# EAGLE schematic LCDShieldC144MVGI v1 (EAGLE 5.11)
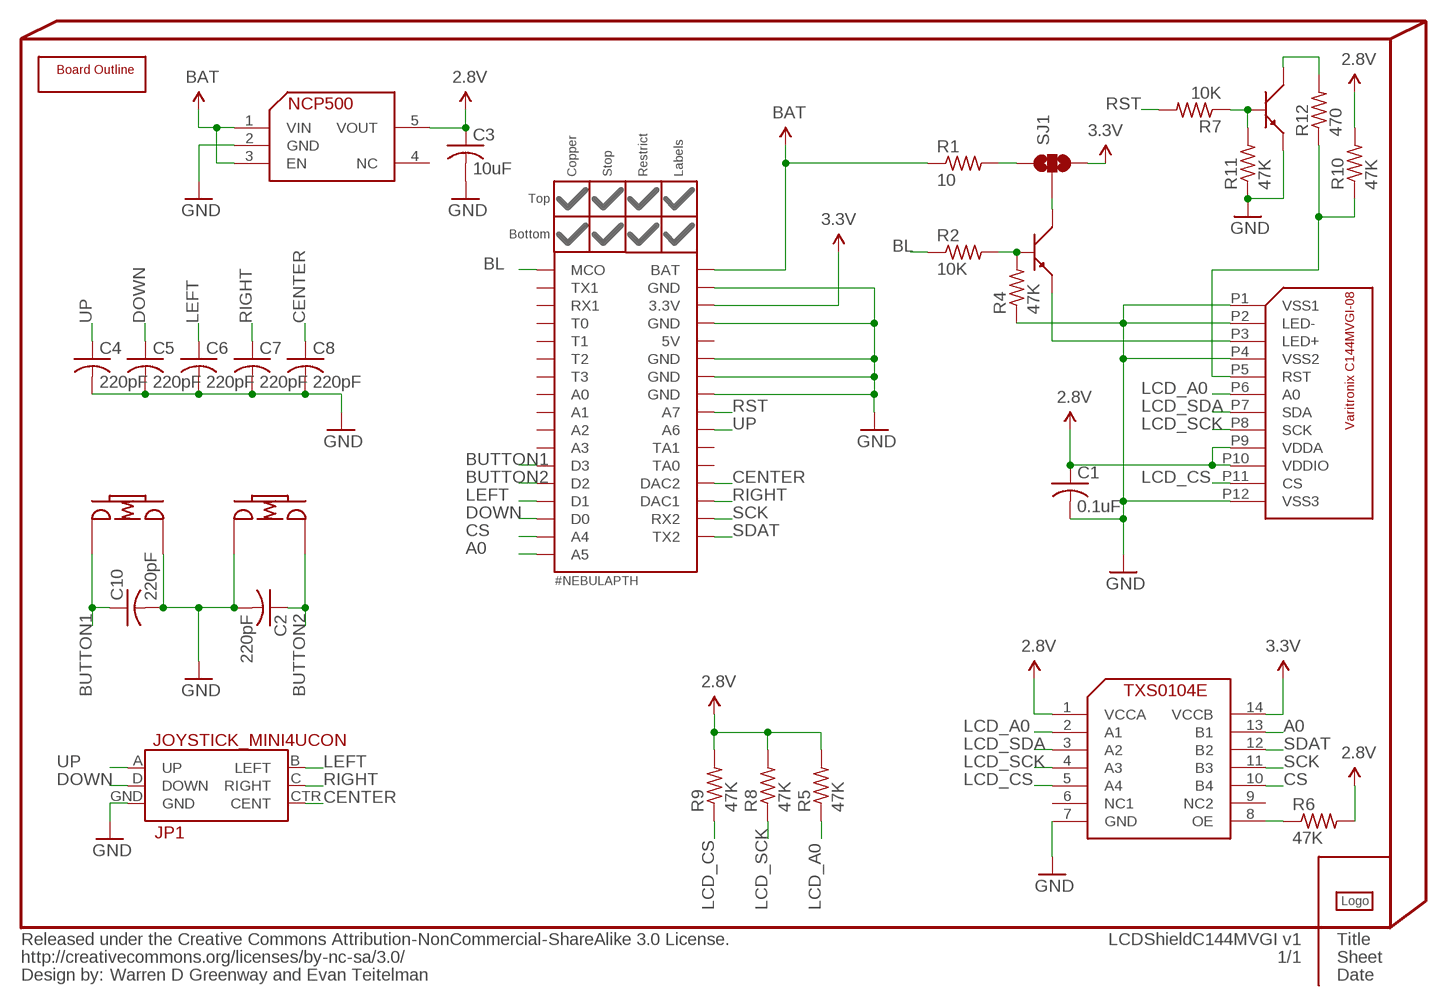
[diagram p0: schematic, sheet 1]

## Parts
BOARDOUTLINE  #NEBULA-VARITRONIX-OUTLINE  [#NEBULA-VARITRONIX-OUTLINE]
C1  0.1uF  C-USC0402  [C0402]
C2  220pF  C-USC0402  [C0402]
C3  10uF  C-USC0805  [C0805]
C4  220pF  C-USC0402  [C0402]
C5  220pF  C-USC0402  [C0402]
C6  220pF  C-USC0402  [C0402]
C7  220pF  C-USC0402  [C0402]
C8  220pF  C-USC0402  [C0402]
C10  220pF  C-USC0402  [C0402]
INFO3  Warren D Greenway and Evan Teitelman  %CC-NC-SA  [%CC-NC-SA]
JP1  JOYSTICK_MINI4UCON  [JOYSTICK_MINI]
LOGO1  #PYGMYLOGOLARGE  [#PYGMYLOGO]
NEBULA1  #NEBULAPTH  [#NEBULA-PTH]
R1  10  R-US_R0805  [R0805]
R2  10K  R-US_R0402  [R0402]
R4  47K  R-US_R0402  [R0402]
R5  47K  R-US_R0402  [R0402]
R6  47K  R-US_R0402  [R0402]
R7  10K  R-US_R0402  [R0402]
R8  47K  R-US_R0402  [R0402]
R9  47K  R-US_R0402  [R0402]
R10  47K  R-US_R0402  [R0402]
R11  47K  R-US_R0402  [R0402]
R12  470  R-US_R0402  [R0402]
SJ1  SOLDERJUMPER_2WAYPASTE1&2  [SJ_3_PASTE1&2]
U1  VARITRONIX_COG-C144MVGI-08FOLDED  [VARITRONIX_COG-C144MVGI-08_FOLDED]
U2  BIPOLAR-PMBT6428  [DUBLIB_SOT23]
U3  INTERFACE-TXS0104E  [PW_R-PDSO-G14]
U4  NCP500  [SOT23-5L]
U5  BIPOLAR-PMBT6428  [DUBLIB_SOT23]
U6  SWITCH-ALPS-SKRG  [SWITCH-2P-5MM]
U7  SWITCH-ALPS-SKRG  [SWITCH-2P-5MM]

## Nets
2.8V: C1.1 C3.1 R5.2 R6.2 R8.2 R9.2 R10.2 U1.P9(VDDA) U1.P10(VDDIO) U3.1(VCCA) U4.5(VOUT) ; supply symbol labelled @2.8V
3.3V: NEBULA1.3.3V SJ1.3 U3.14(VCCB) ; supply symbol labelled @3.3V
A0: NEBULA1.A5 U3.13(B1)
BAT: NEBULA1.BAT R1.1 U4.1(VIN) U4.3(EN) ; supply symbol labelled @BAT
BL: NEBULA1.MCO R2.1
BUTTON1: C10.1 NEBULA1.D3 U7.P1
BUTTON2: C2.1 NEBULA1.D2 U6.P2
CENTER: C8.1 JP1.CTR(CENT) NEBULA1.DAC2
CS: NEBULA1.A4 U3.10(B4)
DOWN: C5.1 JP1.D(DOWN) NEBULA1.D0
GND: C1.2 C2.2 C3.2 C4.2 C5.2 C6.2 C7.2 C8.2 C10.2 JP1.GND NEBULA1.GND1(GND) NEBULA1.GND2(GND) NEBULA1.GND3(GND) NEBULA1.GND4(GND) NEBULA1.GND5(GND) R4.1 R11.1 U1.P1(VSS1) U1.P2(LED-) U1.P4(VSS2) U1.P12(VSS3) U3.7(GND) U4.2(GND) U5.2 U6.P1 U7.P2 ; supply symbol labelled @GND
LCD_A0: R5.1 U1.P6(A0) U3.2(A1)
LCD_CS: R9.1 U1.P11(CS) U3.5(A4)
LCD_SCK: R8.1 U1.P8(SCK) U3.4(A3)
LCD_SDA: U1.P7(SDA) U3.3(A2)
LEFT: C6.1 JP1.B(LEFT) NEBULA1.D1
N$1: SJ1.2 U2.3
N$2: R1.2 SJ1.1
N$3: R6.1 U3.8(OE)
N$4: R7.1 R11.2 U5.1
N$5: R12.2 U5.3
N$6: U1.P3(LED+) U2.2
N$7: R2.2 R4.2 U2.1
N$9: R10.1 R12.1 U1.P5(RST)
RIGHT: C7.1 JP1.C(RIGHT) NEBULA1.DAC1
RST: NEBULA1.A7 R7.2
SCK: NEBULA1.COM2_RX(RX2) U3.11(B3)
SDAT: NEBULA1.COM2_TX(TX2) U3.12(B2)
UP: C4.1 JP1.A(UP) NEBULA1.A6
Unconnected: NEBULA1.5V NEBULA1.A0 NEBULA1.A1 NEBULA1.A2 NEBULA1.A3 NEBULA1.COM1_RX(RX1) NEBULA1.COM1_TX(TX1) NEBULA1.T0 NEBULA1.T1 NEBULA1.T2 NEBULA1.T3 NEBULA1.TA0 NEBULA1.TA1 U3.6(NC1) U3.9(NC2) U4.4(NC)

## Library data of the parts
BOARDOUTLINE = PygmyBoards:#NEBULA-VARITRONIX-OUTLINE
C1-C8 C10 = rcl:C-US: CAPACITOR, American symbol
INFO3 = PygmyBoards:%CC-NC-SA: Released under the Creative Commons Attribution-NonCommercial-ShareAlike 3.0 License. http://creativecommons.org/licenses/by-sa/3.0 Design by: [Designer Name] Change this part's value to change the designer name
JP1 = SparkFun:JOYSTICK_MINI
LOGO1 = Pygmy:#PYGMYLOGO
NEBULA1 = PygmyBoards:#NEBULA: Nebula Board and Shield Footprint Pads This is the only absolutely required part for the footprint. The parts in "#NEBULA-PART" are merely aesthetic. A circular board outline should be .001" thick and 1.005" in diameter (Reference circle on the Document (48) layer provided).
R1 R2 R4-R12 = rcl:R-US_: RESISTOR, American symbol
SJ1 = Pygmy:SOLDERJUMPER_2WAY: Solder Jumper 2 way solder jumper
U1 = Pygmy:VARITRONIX_COG-C144MVGI-08
U2 U5 = Pygmy:BIPOLAR-PMBT6428
U3 = Pygmy:INTERFACE-TXS0104E
U4 = Pygmy:NCP500
U6 U7 = Pygmy:SWITCH-ALPS-SKRG